# Altium schematic sheet P10 DDRC&D NOVTT.SchDoc
size 420 x 297 mm
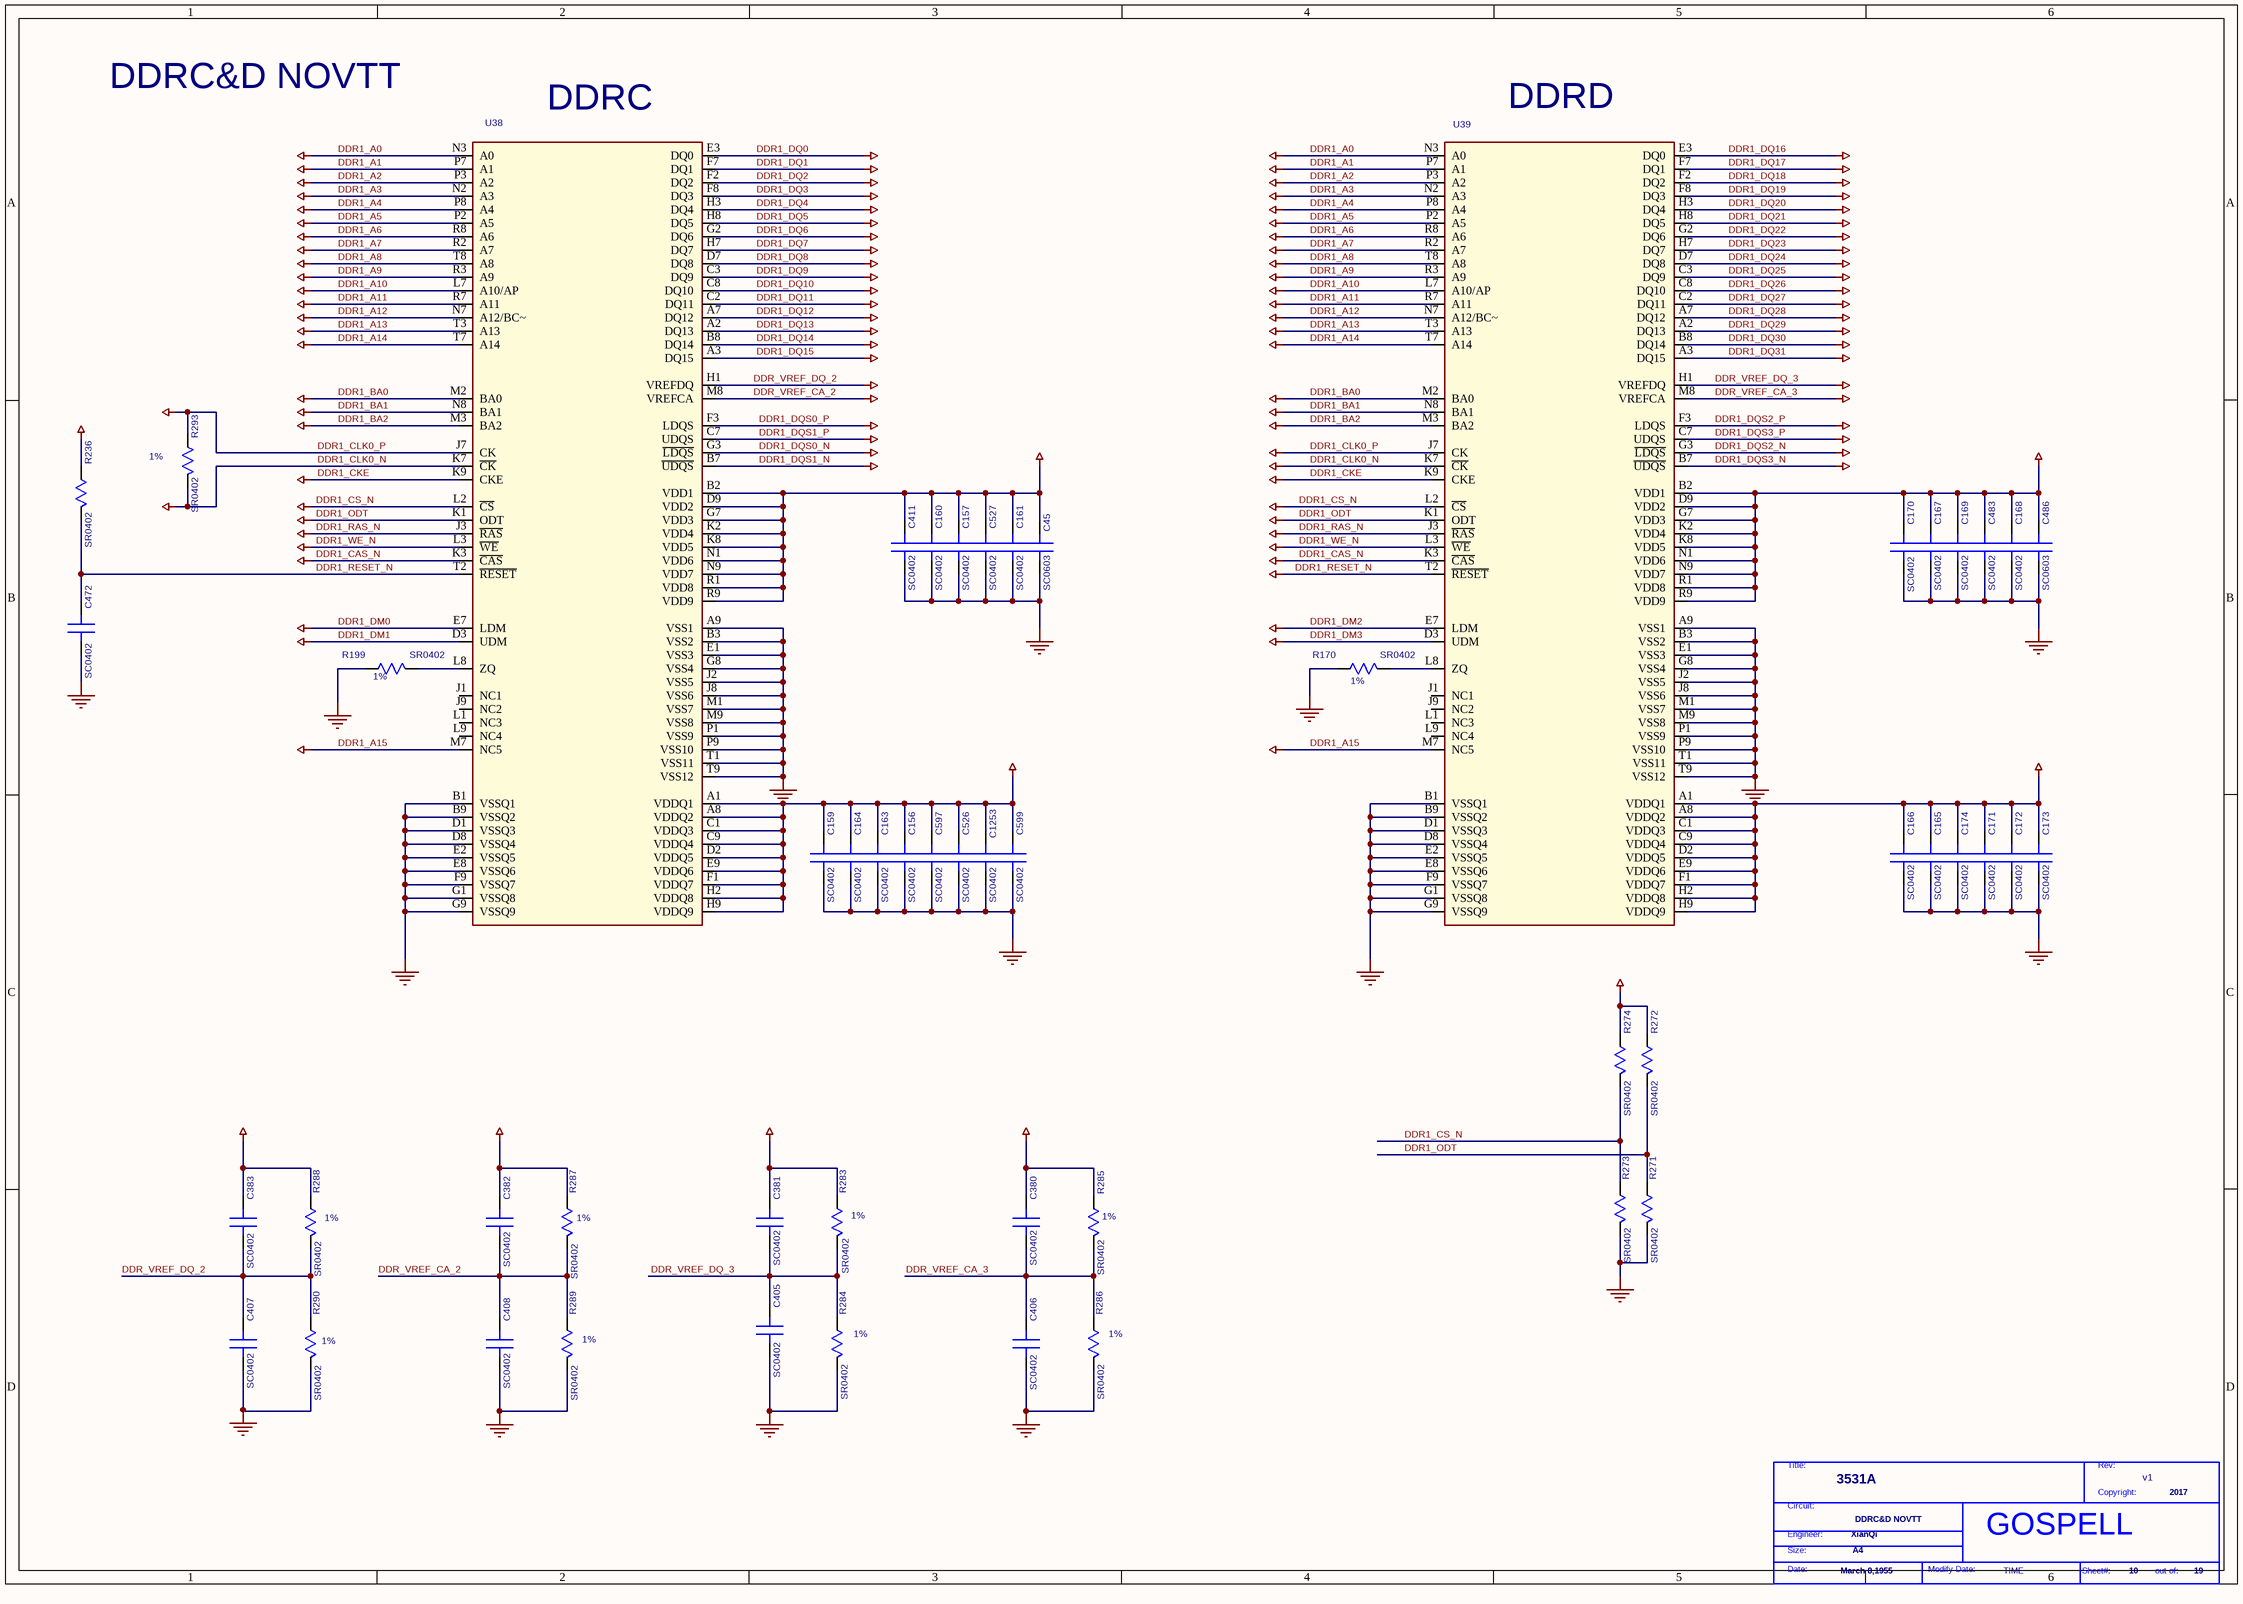
[diagram p0: P10 DDRC&D NOVTT.SchDoc]

## Parts
*  Page Modify Date: TIME  Engineer: XianQi  Copyright: 2017  Title: 3531A  RevCode: v1  Page Size: A4  Page Create Date: March 8,1955  Page Number: 10  Page Count: 19  Doc: DDRC&D NOVTT  (hidden comment: GOSPELL)  (graphical)
C45  SC0603  [SC0603]
C156  SC0402  [SC0402]
C157  SC0402  [SC0402]
C159  SC0402  [SC0402]
C160  SC0402  [SC0402]
C161  SC0402  [SC0402]
C163  SC0402  [SC0402]
C164  SC0402  [SC0402]
C165  SC0402  [SC0402]
C166  SC0402  [SC0402]
C167  SC0402  [SC0402]
C168  SC0402  [SC0402]
C169  SC0402  [SC0402]
C170  SC0402  [SC0402]
C171  SC0402  [SC0402]
C172  SC0402  [SC0402]
C173  SC0402  [SC0402]
C174  SC0402  [SC0402]
C380  SC0402  [SC0402]
C381  SC0402  [SC0402]
C382  SC0402  [SC0402]
C383  SC0402  [SC0402]
C405  SC0402  [SC0402]
C406  SC0402  [SC0402]
C407  SC0402  [SC0402]
C408  SC0402  [SC0402]
C411  SC0402  [SC0402]
C472  SC0402  [SC0402]
C483  SC0402  [SC0402]
C486  SC0603  [SC0603]
C526  SC0402  [SC0402]
C527  SC0402  [SC0402]
C597  SC0402  [SC0402]
C599  SC0402  [SC0402]
C1253  SC0402  [SC0402]
R170  SR0402  [SR0402]
R199  SR0402  [SR0402]
R236  SR0402  [SR0402]
R271  SR0402  [SR0402]
R272  SR0402  [SR0402]
R273  SR0402  [SR0402]
R274  SR0402  [SR0402]
R283  SR0402  [SR0402]
R284  SR0402  [SR0402]
R285  SR0402  [SR0402]
R286  SR0402  [SR0402]
R287  SR0402  [SR0402]
R288  SR0402  [SR0402]
R289  SR0402  [SR0402]
R290  SR0402  [SR0402]
R293  SR0402  [SR0402]
U38  BGA96-32-1609M  [BGA96-32-1609M]  (value not drawn)
U39  BGA96-32-1609M  [BGA96-32-1609M]  (value not drawn)

## Nets
1V5: C45.1(A) C156.1(A) C157.1(A) C159.1(A) C160.1(A) C161.1(A) C163.1(A) C164.1(A) C165.1(A) C166.1(A) C167.1(A) C168.1(A) C169.1(A) C170.1(A) C171.1(A) C172.1(A) C173.1(A) C174.1(A) C380.1(A) C381.1(A) C382.1(A) C383.1(A) C411.1(A) C483.1(A) C486.1(A) C526.1(A) C527.1(A) C597.1(A) C599.1(A) C1253.1(A) R236.1(A) R272.1(A) R274.1(A) R283.1(A) R285.1(A) R287.1(A) R288.1(A) U38.A1(VDDQ1) U38.A8(VDDQ2) U38.B2(VDD1) U38.C1(VDDQ3) U38.C9(VDDQ4) U38.D2(VDDQ5) U38.D9(VDD2) U38.E9(VDDQ6) U38.F1(VDDQ7) U38.G7(VDD3) U38.H2(VDDQ8) U38.H9(VDDQ9) U38.K2(VDD4) U38.K8(VDD5) U38.N1(VDD6) U38.N9(VDD7) U38.R1(VDD8) U38.R9(VDD9) U39.A1(VDDQ1) U39.A8(VDDQ2) U39.B2(VDD1) U39.C1(VDDQ3) U39.C9(VDDQ4) U39.D2(VDDQ5) U39.D9(VDD2) U39.E9(VDDQ6) U39.F1(VDDQ7) U39.G7(VDD3) U39.H2(VDDQ8) U39.H9(VDDQ9) U39.K2(VDD4) U39.K8(VDD5) U39.N1(VDD6) U39.N9(VDD7) U39.R1(VDD8) U39.R9(VDD9)
DDR1_A0: U38.N3(A0) U39.N3(A0)
DDR1_A1: U38.P7(A1) U39.P7(A1)
DDR1_A2: U38.P3(A2) U39.P3(A2)
DDR1_A3: U38.N2(A3) U39.N2(A3)
DDR1_A4: U38.P8(A4) U39.P8(A4)
DDR1_A5: U38.P2(A5) U39.P2(A5)
DDR1_A6: U38.R8(A6) U39.R8(A6)
DDR1_A7: U38.R2(A7) U39.R2(A7)
DDR1_A8: U38.T8(A8) U39.T8(A8)
DDR1_A9: U38.R3(A9) U39.R3(A9)
DDR1_A10: U38.L7(A10/AP) U39.L7(A10/AP)
DDR1_A11: U38.R7(A11) U39.R7(A11)
DDR1_A12: U38.N7(A12/BC~) U39.N7(A12/BC~)
DDR1_A13: U38.T3(A13) U39.T3(A13)
DDR1_A14: U38.T7(A14) U39.T7(A14)
DDR1_A15: U38.M7(NC5) U39.M7(NC5)
DDR1_BA0: U38.M2(BA0) U39.M2(BA0)
DDR1_BA1: U38.N8(BA1) U39.N8(BA1)
DDR1_BA2: U38.M3(BA2) U39.M3(BA2)
DDR1_CAS_N: U38.K3(~{CAS}) U39.K3(~{CAS})
DDR1_CKE: U38.K9(CKE) U39.K9(CKE)
DDR1_CLK0_N: R293.2(B) U38.K7(~{CK}) U39.K7(~{CK})
DDR1_CLK0_P: R293.1(A) U38.J7(CK) U39.J7(CK)
DDR1_CS_N: R273.1(A) R274.2(B) U38.L2(~{CS}) U39.L2(~{CS})
DDR1_DM0: U38.E7(LDM)
DDR1_DM1: U38.D3(UDM)
DDR1_DM2: U39.E7(LDM)
DDR1_DM3: U39.D3(UDM)
DDR1_DQ0: U38.E3(DQ0)
DDR1_DQ1: U38.F7(DQ1)
DDR1_DQ2: U38.F2(DQ2)
DDR1_DQ3: U38.F8(DQ3)
DDR1_DQ4: U38.H3(DQ4)
DDR1_DQ5: U38.H8(DQ5)
DDR1_DQ6: U38.G2(DQ6)
DDR1_DQ7: U38.H7(DQ7)
DDR1_DQ8: U38.D7(DQ8)
DDR1_DQ9: U38.C3(DQ9)
DDR1_DQ10: U38.C8(DQ10)
DDR1_DQ11: U38.C2(DQ11)
DDR1_DQ12: U38.A7(DQ12)
DDR1_DQ13: U38.A2(DQ13)
DDR1_DQ14: U38.B8(DQ14)
DDR1_DQ15: U38.A3(DQ15)
DDR1_DQ16: U39.E3(DQ0)
DDR1_DQ17: U39.F7(DQ1)
DDR1_DQ18: U39.F2(DQ2)
DDR1_DQ19: U39.F8(DQ3)
DDR1_DQ20: U39.H3(DQ4)
DDR1_DQ21: U39.H8(DQ5)
DDR1_DQ22: U39.G2(DQ6)
DDR1_DQ23: U39.H7(DQ7)
DDR1_DQ24: U39.D7(DQ8)
DDR1_DQ25: U39.C3(DQ9)
DDR1_DQ26: U39.C8(DQ10)
DDR1_DQ27: U39.C2(DQ11)
DDR1_DQ28: U39.A7(DQ12)
DDR1_DQ29: U39.A2(DQ13)
DDR1_DQ30: U39.B8(DQ14)
DDR1_DQ31: U39.A3(DQ15)
DDR1_DQS0_N: U38.G3(~{LDQS})
DDR1_DQS0_P: U38.F3(LDQS)
DDR1_DQS1_N: U38.B7(~{UDQS})
DDR1_DQS1_P: U38.C7(UDQS)
DDR1_DQS2_N: U39.G3(~{LDQS})
DDR1_DQS2_P: U39.F3(LDQS)
DDR1_DQS3_N: U39.B7(~{UDQS})
DDR1_DQS3_P: U39.C7(UDQS)
DDR1_ODT: R271.1(A) R272.2(B) U38.K1(ODT) U39.K1(ODT)
DDR1_RAS_N: U38.J3(~{RAS}) U39.J3(~{RAS})
DDR1_RESET_N: C472.1(A) R236.2(B) U38.T2(~{RESET}) U39.T2(~{RESET})
DDR1_WE_N: U38.L3(~{WE}) U39.L3(~{WE})
DDR_VREF_CA_2: C382.2(B) C408.1(A) R287.2(B) R289.1(A) U38.M8(VREFCA)
DDR_VREF_CA_3: C380.2(B) C406.1(A) R285.2(B) R286.1(A) U39.M8(VREFCA)
DDR_VREF_DQ_2: C383.2(B) C407.1(A) R288.2(B) R290.1(A) U38.H1(VREFDQ)
DDR_VREF_DQ_3: C381.2(B) C405.1(A) R283.2(B) R284.1(A) U39.H1(VREFDQ)
GND: C45.2(B) C156.2(B) C157.2(B) C159.2(B) C160.2(B) C161.2(B) C163.2(B) C164.2(B) C165.2(B) C166.2(B) C167.2(B) C168.2(B) C169.2(B) C170.2(B) C171.2(B) C172.2(B) C173.2(B) C174.2(B) C405.2(B) C406.2(B) C407.2(B) C408.2(B) C411.2(B) C472.2(B) C483.2(B) C486.2(B) C526.2(B) C527.2(B) C597.2(B) C599.2(B) C1253.2(B) R170.1(A) R199.1(A) R271.2(B) R273.2(B) R284.2(B) R286.2(B) R289.2(B) R290.2(B) U38.A9(VSS1) U38.B1(VSSQ1) U38.B3(VSS2) U38.B9(VSSQ2) U38.D1(VSSQ3) U38.D8(VSSQ4) U38.E1(VSS3) U38.E2(VSSQ5) U38.E8(VSSQ6) U38.F9(VSSQ7) U38.G1(VSSQ8) U38.G8(VSS4) U38.G9(VSSQ9) U38.J2(VSS5) U38.J8(VSS6) U38.M1(VSS7) U38.M9(VSS8) U38.P1(VSS9) U38.P9(VSS10) U38.T1(VSS11) U38.T9(VSS12) U39.A9(VSS1) U39.B1(VSSQ1) U39.B3(VSS2) U39.B9(VSSQ2) U39.D1(VSSQ3) U39.D8(VSSQ4) U39.E1(VSS3) U39.E2(VSSQ5) U39.E8(VSSQ6) U39.F9(VSSQ7) U39.G1(VSSQ8) U39.G8(VSS4) U39.G9(VSSQ9) U39.J2(VSS5) U39.J8(VSS6) U39.M1(VSS7) U39.M9(VSS8) U39.P1(VSS9) U39.P9(VSS10) U39.T1(VSS11) U39.T9(VSS12)
NetR170_2: R170.2(B) U39.L8(ZQ)
NetR199_2: R199.2(B) U38.L8(ZQ)

Not connected (* = marked no-connect by the designer): U38 J1(NC1) J9(NC2) L1(NC3) L9(NC4); U39 J1(NC1) J9(NC2) L1(NC3) L9(NC4)

## Notes on the sheet
- DDRC&D NOVTT
- (near U38) DDRC
- (near U39) DDRD
- (near R293) 1%
- (near R199) 1%
- (near R170) 1%
- (near R288) 1%
- (near R287) 1%
- (near R283) 1%
- (near R285) 1%
- (near R290) 1%
- (near R289) 1%
- (near R284) 1%
- (near R286) 1%
- (in symbol GOSPELL) Title:; Rev:; Copyright:; Circuit:; Engineer:; Size:; Date:; Modify Date:; Sheet#:; out of:

## Library data of the parts
C45 C486 = C_0_Dup2: PARTS: 1; PINSWAP: (A,B); LEVEL: STD; DEVICE: C1608X5R0J106MT0A0E; OriginalSymbolOrigin: (0,30); CODE: 8070649; %195%%232%%202%%246%: SMD陶瓷电容-6.3V-10000NF-+/-20%-X5R-0603-BT,TS16949; %182%%238%%182%%168%%185%%164%%215%%247%%181%%231%%209%%185%(V): 6.3; COMPONENT_HIGH_MAX: 0.9MM; %208%%161%%192%%224%%195%%251%%179%%198%: SMD陶瓷电容; PKG_TYPE: SC0603
C156 C159 C163 C167 C173 C174 C380 C382 C383 C411 = C_0_Dup2: PARTS: 1; PINSWAP: (A,B); LEVEL: STD; DEVICE: RMEMK105BJ104KV_FR; OriginalSymbolOrigin: (0,30); CODE: 8070614; %195%%232%%202%%246%: SMD陶瓷电容-16V-100NF-+/-10%-X7R-0402-BT; %182%%238%%182%%168%%185%%164%%215%%247%%181%%231%%209%%185%(V): 16; COMPONENT_HIGH_MAX: 0.55MM; %208%%161%%192%%224%%195%%251%%179%%198%: SMD陶瓷电容; PKG_TYPE: SC0402
C157 C160 C164-C166 C170 C381 C405-C408 = C_0_Dup2: PARTS: 1; PINSWAP: (A,B); LEVEL: STD; DEVICE: RMEMK105BJ104KV_FR; OriginalSymbolOrigin: (0,30); %208%%161%%192%%224%%195%%251%%179%%198%: SMD陶瓷电容; COMPONENT_HIGH_MAX: 0.55MM; %182%%238%%182%%168%%185%%164%%215%%247%%181%%231%%209%%185%(V): 16; %195%%232%%202%%246%: SMD陶瓷电容-16V-100NF-+/-10%-X7R-0402-BT; CODE: 8070614; PKG_TYPE: SC0402
C161 C172 = C_0_Dup2: PARTS: 1; PINSWAP: (A,B); LEVEL: STD; DEVICE: CV05X5R105K10AH; OriginalSymbolOrigin: (0,30); %208%%161%%192%%224%%195%%251%%179%%198%: SMD陶瓷电容; COMPONENT_HIGH_MAX: 0.55MM; %182%%238%%182%%168%%185%%164%%215%%247%%181%%231%%209%%185%(V): 10; %195%%232%%202%%246%: SMD陶瓷电容-10V-1000NF-+/-10%-X5R-0402-BT,TS16949; CODE: 8070612; PKG_TYPE: SC0402
C168 C483 C599 C1253 = C_0_Dup2: PARTS: 1; PINSWAP: (A,B); LEVEL: STD; DEVICE: CV05X5R105K10AH; OriginalSymbolOrigin: (0,30); CODE: 8070612; %195%%232%%202%%246%: SMD陶瓷电容-10V-1000NF-+/-10%-X5R-0402-BT,TS16949; %182%%238%%182%%168%%185%%164%%215%%247%%181%%231%%209%%185%(V): 10; COMPONENT_HIGH_MAX: 0.55MM; %208%%161%%192%%224%%195%%251%%179%%198%: SMD陶瓷电容; PKG_TYPE: SC0402
C169 C526 C527 = C_0_Dup2: PARTS: 1; PINSWAP: (A,B); LEVEL: STD; DEVICE: GRM155R60J474KE19D; OriginalSymbolOrigin: (0,30); %208%%161%%192%%224%%195%%251%%179%%198%: SMD陶瓷电容; COMPONENT_HIGH_MAX: 0.55MM; %182%%238%%182%%168%%185%%164%%215%%247%%181%%231%%209%%185%(V): 6.3; %195%%232%%202%%246%: SMD陶瓷电容-6.3V-470NF-+/-10%-X5R-0402; CODE: 8070625; PKG_TYPE: SC0402
C171 C597 = C_0_Dup2: PARTS: 1; PINSWAP: (A,B); LEVEL: STD; DEVICE: GRM155R60J474KE19D; OriginalSymbolOrigin: (0,30); CODE: 8070625; %195%%232%%202%%246%: SMD陶瓷电容-6.3V-470NF-+/-10%-X5R-0402; %182%%238%%182%%168%%185%%164%%215%%247%%181%%231%%209%%185%(V): 6.3; COMPONENT_HIGH_MAX: 0.55MM; %208%%161%%192%%224%%195%%251%%179%%198%: SMD陶瓷电容; PKG_TYPE: SC0402
C472 = C_0_Dup2: PARTS: 1; PINSWAP: (A,B); LEVEL: STD; DEVICE: 04025C102KAT2A; OriginalSymbolOrigin: (0,30); %208%%161%%192%%224%%195%%251%%179%%198%: SMD陶瓷电容; COMPONENT_HIGH_MAX: 0.56MM; %182%%238%%182%%168%%185%%164%%215%%247%%181%%231%%209%%185%(V): 50; %195%%232%%202%%246%: SMD陶瓷电容-50V-1NF-+/-10%-X7R-0402-BT; CODE: 8070531; PKG_TYPE: SC0402
R170 R199 = R_1: PARTS: 1; LEVEL: STD; DEVICE: RC0402FR_07240RL; PINSWAP: (A,B); OriginalSymbolOrigin: (10,20); CODE: 7091782; %195%%232%%202%%246%: 片式厚膜电阻器-0.0625W-240OHM-+/- 1%-0402-BT; %182%%238%%182%%168%%185%%166%%194%%202%(W): 0.06; %215%%232%%214%%181%%212%%202%%208%%237%%198%%171%%178%%238%: +/- 1%; COMPONENT_HIGH_MAX: 0.4MM; %208%%161%%192%%224%%195%%251%%179%%198%: 片式厚膜电阻器; PKG_TYPE: SR0402
R236 = R_1: PARTS: 1; LEVEL: STD; DEVICE: RK73H1ETTP1002F; PINSWAP: (A,B); OriginalSymbolOrigin: (10,20); CODE: 7090867; %195%%232%%202%%246%: 片式厚膜电阻器-0.0625W-10000OHM-+/-1%-0402-BT; %182%%238%%182%%168%%185%%166%%194%%202%(W): 0.06; %215%%232%%214%%181%%212%%202%%208%%237%%198%%171%%178%%238%: +/-1%; COMPONENT_HIGH_MAX: 0.4MM; %208%%161%%192%%224%%195%%251%%179%%198%: 片式厚膜电阻器; PKG_TYPE: SR0402
R271 R272 = R_1: PARTS: 1; LEVEL: STD; DEVICE: RC0402JR_07100R; PINSWAP: (A,B); OriginalSymbolOrigin: (10,20); CODE: 7090807; %195%%232%%202%%246%: 片式厚膜电阻器-0.0625W-100OHM-+/-5%-0402-BT; %182%%238%%182%%168%%185%%166%%194%%202%(W): 0.06; %215%%232%%214%%181%%212%%202%%208%%237%%198%%171%%178%%238%: +/-5%; COMPONENT_HIGH_MAX: 0.4MM; %208%%161%%192%%224%%195%%251%%179%%198%: 片式厚膜电阻器; PKG_TYPE: SR0402
R273 R274 = R_1: PARTS: 1; LEVEL: STD; DEVICE: RC0402JR_07100R; PINSWAP: (A,B); OriginalSymbolOrigin: (10,20); %208%%161%%192%%224%%195%%251%%179%%198%: 片式厚膜电阻器; COMPONENT_HIGH_MAX: 0.4MM; %215%%232%%214%%181%%212%%202%%208%%237%%198%%171%%178%%238%: +/-5%; %182%%238%%182%%168%%185%%166%%194%%202%(W): 0.06; %195%%232%%202%%246%: 片式厚膜电阻器-0.0625W-100OHM-+/-5%-0402-BT; CODE: 7090807; PKG_TYPE: SR0402
R283 R285 R286 R289 = R_1: PARTS: 1; LEVEL: STD; DEVICE: RC0402FR_071KL; PINSWAP: (A,B); OriginalSymbolOrigin: (10,20); CODE: 7091282; %195%%232%%202%%246%: 片式厚膜电阻器-0.0625W-1000OHM-+/-1%-0402-BT; %182%%238%%182%%168%%185%%166%%194%%202%(W): 0.06; %215%%232%%214%%181%%212%%202%%208%%237%%198%%171%%178%%238%: +/-1%; COMPONENT_HIGH_MAX: 0.4MM; %208%%161%%192%%224%%195%%251%%179%%198%: 片式厚膜电阻器; PKG_TYPE: SR0402
R284 R287 R288 R290 = R_1: PARTS: 1; LEVEL: STD; DEVICE: RC0402FR_071KL; PINSWAP: (A,B); OriginalSymbolOrigin: (10,20); %208%%161%%192%%224%%195%%251%%179%%198%: 片式厚膜电阻器; COMPONENT_HIGH_MAX: 0.4MM; %215%%232%%214%%181%%212%%202%%208%%237%%198%%171%%178%%238%: +/-1%; %182%%238%%182%%168%%185%%166%%194%%202%(W): 0.06; %195%%232%%202%%246%: 片式厚膜电阻器-0.0625W-1000OHM-+/-1%-0402-BT; CODE: 7091282; PKG_TYPE: SR0402
R293 = R_1: PARTS: 1; LEVEL: STD; DEVICE: RC_02W69R8FT; PINSWAP: (A,B); OriginalSymbolOrigin: (10,20); %208%%161%%192%%224%%195%%251%%179%%198%: 片式厚膜电阻器; COMPONENT_HIGH_MAX: 0.4MM; %215%%232%%214%%181%%212%%202%%208%%237%%198%%171%%178%%238%: +/-1%; %182%%238%%182%%168%%185%%166%%194%%202%(W): 0.06; %195%%232%%202%%246%: 片式厚膜电阻器-0.0625W-69.8OHM-+/-1%-0402; CODE: 7091319; PKG_TYPE: SR0402
U38 = MT41J256M16RE-15E-D_2: PARTS: 1; DEVICE: H5TQ4G63AFR_RDC; LEVEL: STD; OriginalSymbolOrigin: (10,590); COMPONENT_HIGH_MAX: 1.2MM; %195%%232%%202%%246%: DDR3 DRAM-4GBIT-933MHZ-16BIT-1.5V-FBGA96(无铅)-终端专用-00777465; CODE: 40020344; PKG_TYPE: BGA96-32-1609M
U39 = MT41J256M16RE-15E-D_2: PARTS: 1; DEVICE: H5TQ4G63AFR_RDC; LEVEL: STD; OriginalSymbolOrigin: (10,590); CODE: 40020344; %195%%232%%202%%246%: DDR3 DRAM-4GBIT-933MHZ-16BIT-1.5V-FBGA96(无铅)-终端专用-00777465; COMPONENT_HIGH_MAX: 1.2MM; PKG_TYPE: BGA96-32-1609M